# EAGLE design esp8266 (EAGLE 6.5.0)
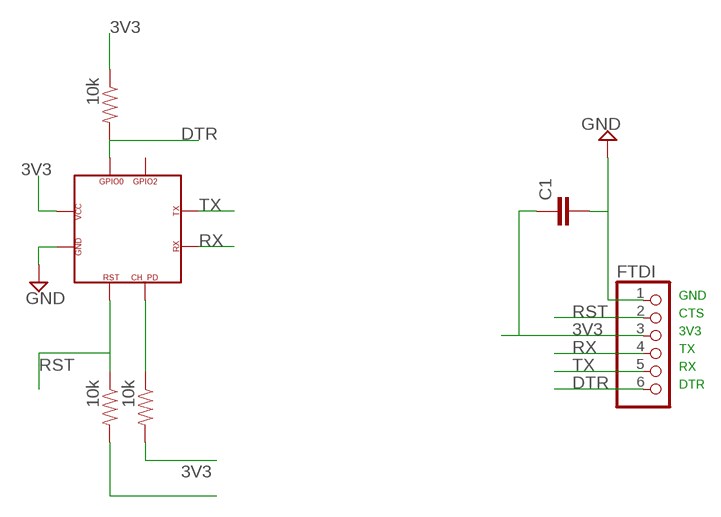
[diagram p0: schematic, sheet 1]

## Parts
C1  CAPEZ  [CAP-PTH-SMALLEZ]
FTDI  PINHD-1X6/90  [1X06/90]
R1  10k  RESISTORPTH-1/2W  [AXIAL-0.5]
R2  10k  RESISTORPTH-1/2W  [AXIAL-0.5]
R3  10k  RESISTORPTH-1/2W  [AXIAL-0.5]
U$1  ESP-01  [ESP-01]

## Nets
3V3: C1.1 FTDI.3 R1.P$1 R2.P$2 R3.P$2 U$1.VCC
DTR: FTDI.6 R1.P$2 U$1.GPIO0
GND: C1.2 FTDI.1 U$1.GND
N$3: R2.P$1 U$1.CH_PD(CP_PD)
RST: FTDI.2 R3.P$1 U$1.RST
RX: FTDI.4 U$1.RXD(RX)
TX: FTDI.5 U$1.TXD(TX)
Unconnected: U$1.GPIO2

## Notes on the sheet
- GND
- CTS
- 3V3
- TX
- RX
- DTR

## Library data of the parts
C1 = SparkFun-Capacitors:CAP: Capacitor Standard 0603 ceramic capacitor, and 0.1" leaded capacitor.
FTDI = pinhead:PINHD-1X6: PIN HEADER
R1-R3 = SparkFun-Passives:RESISTOR: Resistor Basic schematic elements and footprints for 0603, 1206, and PTH resistors.
U$1 = Franc:ESP-01

## Board
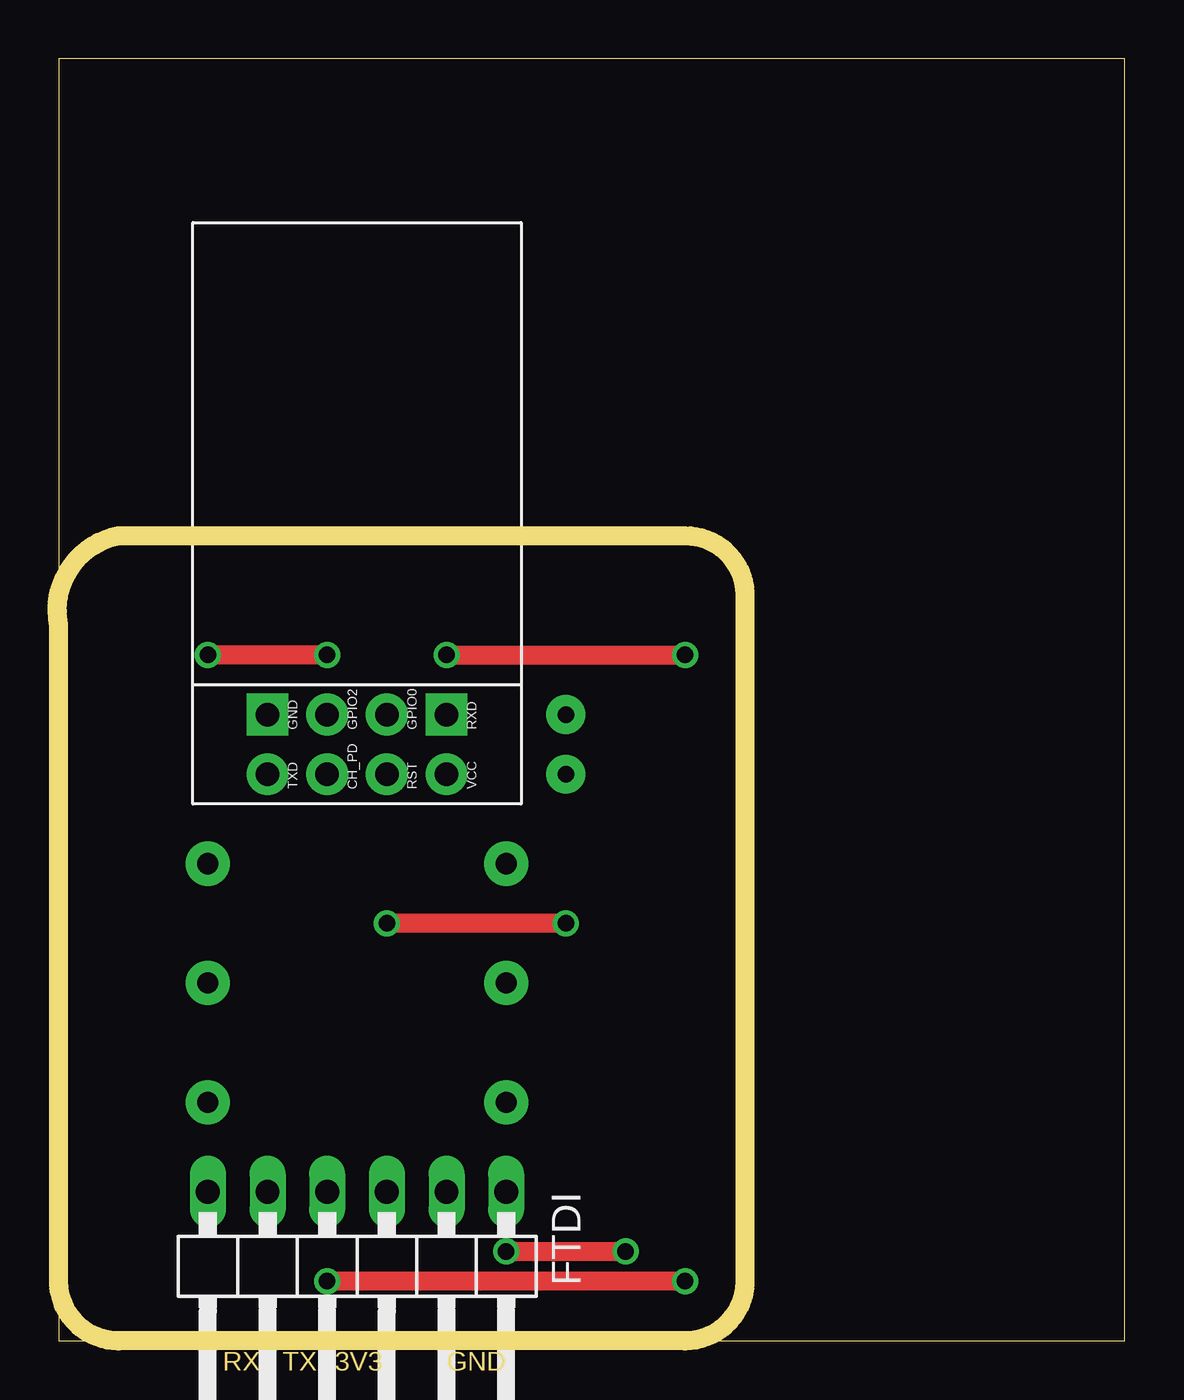
[diagram p1: board, top side]
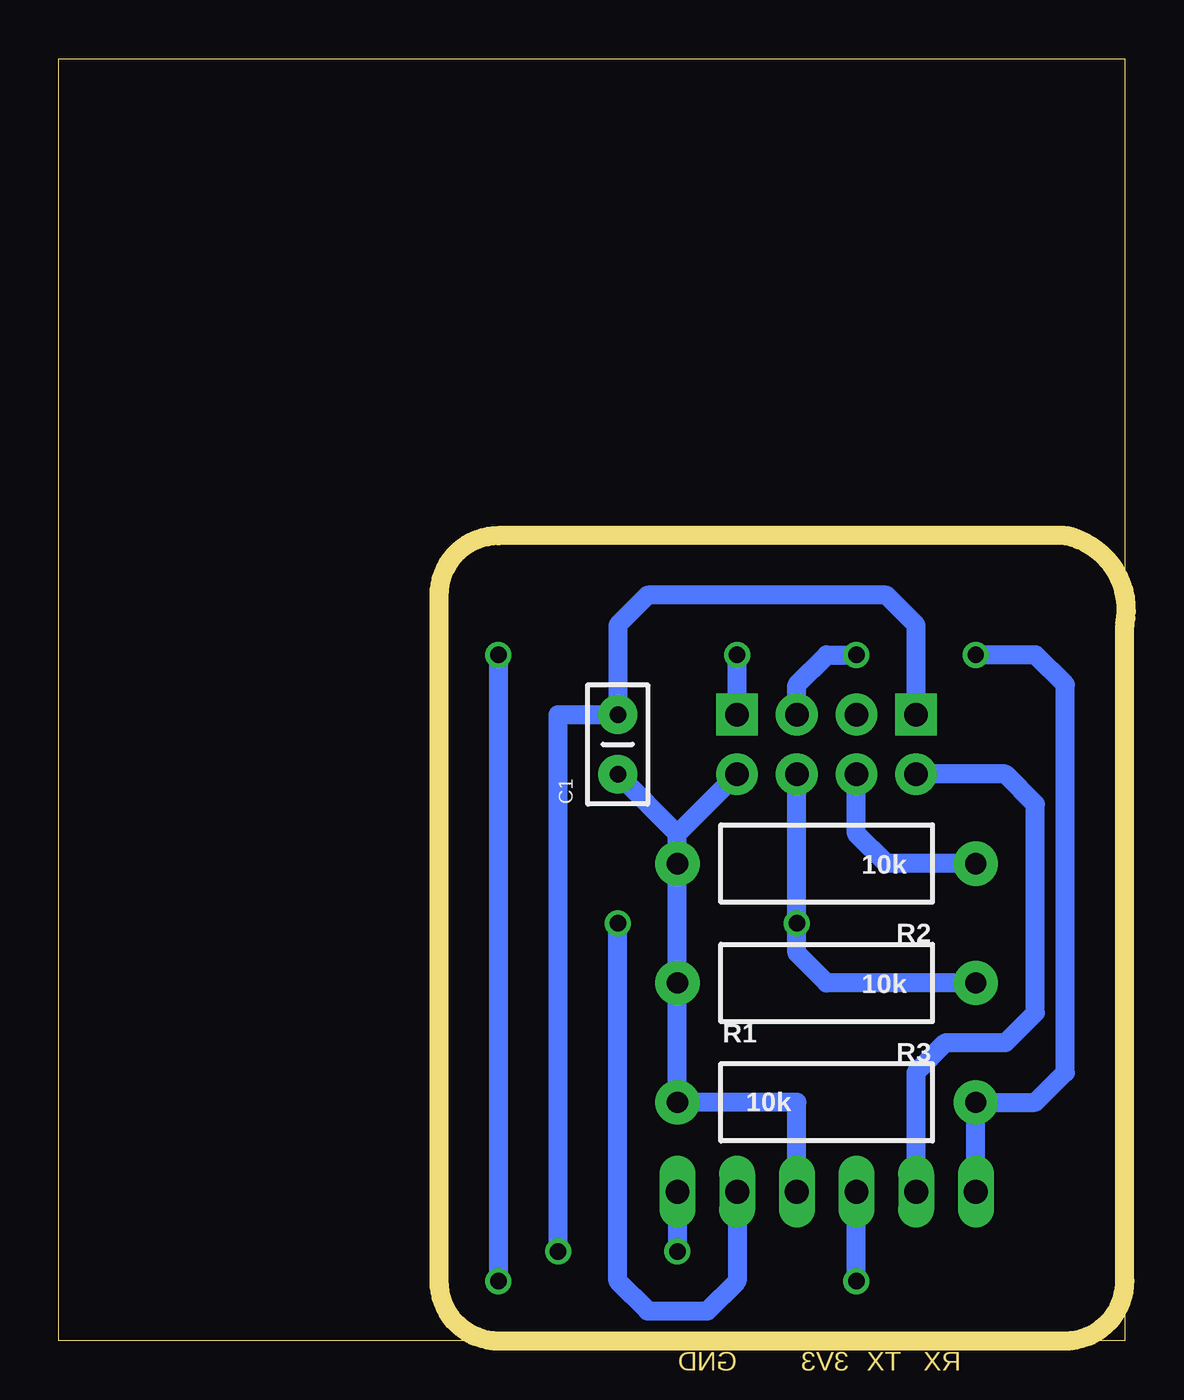
[diagram p2: board, bottom side, seen from below]

Size 45.39 x 54.6 mm. Coordinates in mm from the lower left corner, seen from the top.
Outline: 0,0 45.39,0 45.39,54.6 0,54.6 0,0
Copper layers (1*16): Top 0.035mm / dielectric 1.5mm / Bottom 0.035mm
Design rules "default": minimum track width 10mil, minimum drill 24mil, track to track 8mil, track to pad 8mil, pad to pad 8mil, via to via 8mil, smd to smd 8mil, copper to edge 40mil, drill to drill 8mil, minimum pad ring 10mil, minimum via ring 8mil, stop-mask expansion 4mil, vias tented up to drill 0mil, thermal gap 10mil
Milling: 8 lines

### Footprints (pad centres in the part's own frame; a part is rotated, then mirrored left to right if it is on the bottom)
CAP-PTH-SMALLEZ = drill 0.7 pad 1.651: 1 0,0; 2 2.54,0
1X06/90 = drill 1.016 long: 1 -6.35,-3.81; 2 -3.81,-3.81; 3 -1.27,-3.81; 4 1.27,-3.81; 5 3.81,-3.81; 6 6.35,-3.81
AXIAL-0.5 = drill 0.9 pad 1.88: P$1 -6.35,0; P$2 6.35,0
ESP-01 = drill 1 pad 1.778: CH_PD -1.27,1.27; GPIO0 1.27,-1.27; GPIO2 1.27,1.27; RST -1.27,-1.27; TXD -1.27,3.81; VCC -1.27,-3.81 | drill 1 pad 1.778 square: GND 1.27,3.81; RXD 1.27,-3.81

### Placement (x,y rotation side)
C1  21.59,24.13 90 bottom
FTDI  12.7,2.54 180 top
R1  12.7,10.16 0 bottom
R2  12.7,20.32 180 bottom
R3  12.7,15.24 180 bottom
U$1  12.7,25.4 90 top

### Tracks (layer width: path | path; a pad name or v marks a point on that pad's centre or on a via)
3V3
  Bottom 0.813: FTDI.3 13.97,10.16 R1.P$1 R3.P$2 R2.P$2 19.05,21.59 | 19.05,21.59 U$1.VCC | 19.05,21.59 C1.1
DTR  (via drill 0.7)
  Top 0.813: v11.43,29.21 v6.35,29.21
  Bottom 0.813: FTDI.6 R1.P$2 3.81,10.16 2.54,11.43 2.54,27.94 3.81,29.21 v6.35,29.21 | U$1.GPIO0 13.97,27.94 12.7,29.21 v11.43,29.21
GND  (via drill 0.7)
  Top 0.813: v19.05,3.81 v24.13,3.81
  Bottom 0.813: FTDI.1 v19.05,3.81 | v24.13,3.81 24.13,26.67 C1.2 21.59,30.48 20.32,31.75 10.16,31.75 8.89,30.48 U$1.GND
N$3
  Bottom 0.813: R2.P$1 10.16,20.32 11.43,21.59 U$1.CH_PD
RST  (via drill 0.7)
  Top 0.813: v21.59,17.78 v13.97,17.78
  Bottom 0.813: R3.P$1 12.7,15.24 13.97,16.51 v13.97,17.78 U$1.RST | FTDI.2 16.51,2.54 17.78,1.27 20.32,1.27 21.59,2.54 v21.59,17.78
RX  (via drill 0.7)
  Top 0.813: v16.51,29.21 v26.67,29.21 | v26.67,2.54 v11.43,2.54
  Bottom 0.813: U$1.RXD v16.51,29.21 | v26.67,29.21 v26.67,2.54 | v11.43,2.54 FTDI.4
TX
  Bottom 0.813: FTDI.5 8.89,11.43 7.62,12.7 5.08,12.7 3.81,13.97 3.81,22.86 5.08,24.13 U$1.TXD

### Text on the board
Milling: RX | TX | 3V3 | GND